# Altium schematic sheet ZP_Force_Plates.SchDoc
size Tabloid; Organization: Altium Limited; Address1: L3, 12a Rodborough Rd; Address2: Frenchs Forest; Address3: NSW; Address4: Australia 2086
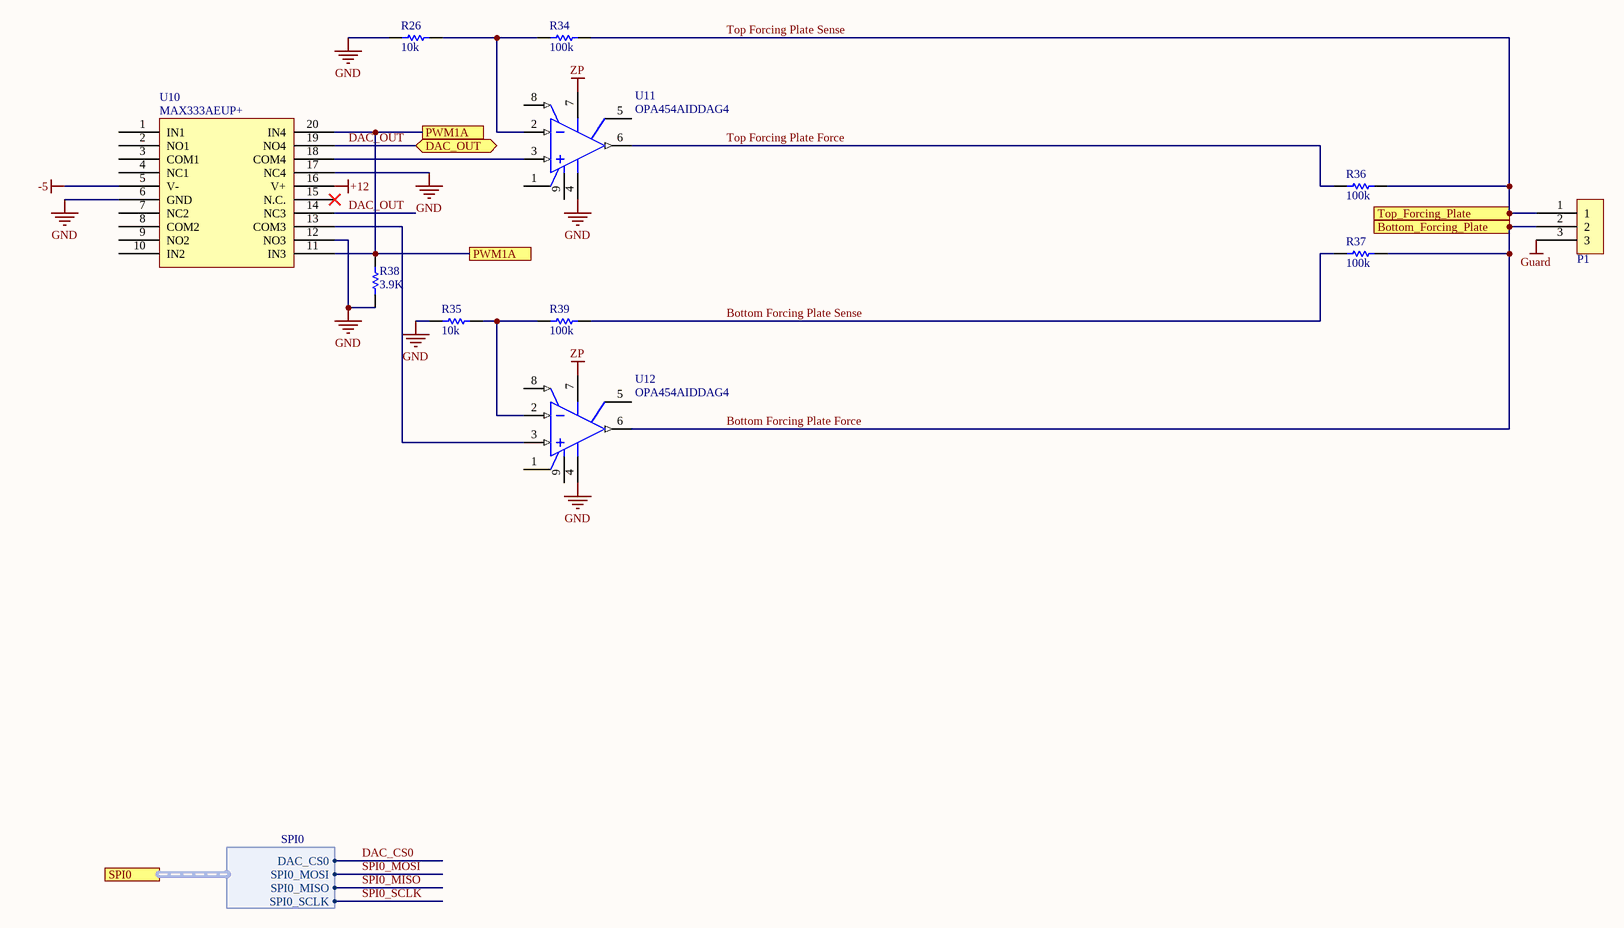
[diagram p0: ZP_Force_Plates.SchDoc]

## Parts
P1  Triax_Conn  [Triax_Conn]  (value not drawn)
R26  10k  [RESC0402(1005)_M]
R34  100k  [RESC0402(1005)_M]
R35  10k  [RESC0402(1005)_M]
R36  100k  [RESC0402(1005)_M]
R37  100k  [RESC0402(1005)_M]
R38  3.9K  [RESC0402(1005)_M]
R39  100k  [RESC0402(1005)_M]
U10  MAX333AEUP+  [TSOP65P640X90-20N]
U11  OPA454AIDDAG4  [TI-DDA8-2745X2245TP_N]
U12  OPA454AIDDAG4  [TI-DDA8-2745X2245TP_N]

## Ports
Bottom_Forcing_Plate, DAC_OUT, PWM1A, SPI0 (harness SPI0), Top_Forcing_Plate

## Harnesses
SPI0: DAC_CS0, SPI0_MOSI, SPI0_MISO, SPI0_SCLK

## Nets
+12: U10.16(V+)
-5: U10.5(V-)
GND: R26.1 R35.1 R38.1 U10.6(GND) U10.12(NO3) U10.17(NC4) U11.4(V-) U12.4(V-)
Guard: P1.3
ZP: U11.7(V+) U12.7(V+)
Bottom Forcing Plate Force: P1.2 R37.1 U12.6(OUT) ; port Bottom_Forcing_Plate
Bottom Forcing Plate Sense: R37.2 R39.2
DAC_CS0: port SPI0.DAC_CS0
DAC_OUT: U10.14(NC3) U10.19(NO4) ; port DAC_OUT
PWM1A: R38.2 U10.11(IN3) U10.20(IN4) ; port PWM1A
SPI0_MISO: port SPI0.SPI0_MISO
SPI0_MOSI: port SPI0.SPI0_MOSI
SPI0_SCLK: port SPI0.SPI0_SCLK
Top Forcing Plate Force: R36.2 U11.6(OUT)
Top Forcing Plate Sense: P1.1 R34.2 R36.1 ; port Top_Forcing_Plate
NetR26_2: R26.2 R34.1 U11.2(IN-)
NetR35_2: R35.2 R39.1 U12.2(IN-)
NetU10_13: U10.13(COM3) U12.3(IN+)
NetU10_18: U10.18(COM4) U11.3(IN+)

Not connected (* = marked no-connect by the designer): U10 1(IN1) 2(NO1) 3(COM1) 4(NC1) 7(NC2) 8(COM2) 9(NO2) 10(IN2) 15(N.C.)*; U11 1(E/D_COM) 5(STATUS_FLAG) 8(E/D) 9(EP); U12 1(E/D_COM) 5(STATUS_FLAG) 8(E/D) 9(EP)

## Notes on the sheet
- Title
- Size:
- Date:
- Tabloid
- Number:
- Time:
- Revision:
- Sheet
- of
- File:

## Library data of the parts
R26 R34 R35 R38 R39 = CMP-1011-00463-1
R36 R37 = CMP-1011-00651-1
U10 = MAX333CWP+: IC SWITCH QUAD SPDT 20TSSOP; Manufacturer: Maxim Integrated; Multiplexer/Demultiplexer Circuit: 2:1; On-State Resistance (Max): 45 Ohm; Channel-to-Channel Matching (&Delta;Ron): 2 Ohm (Max); Voltage - Supply, Single (V+): 10 V ~ 30 V; Voltage - Supply, Dual (V±): ±4.5 V ~ 20 V; Switch Time (Ton, Toff) (Max): 175ns, 145ns; Charge Injection: 2pC; Channel Capacitance (CS(off), CD(off)): 5pF; Current - Leakage (IS(off)) (Max): 250pA; Crosstalk: -78dB @ 1MHz; Supplier 1: Digi-Key; Supplier Part Number 1: MAX333AEUP+-ND; Manufacturer Part Number: MAX333AEUP+; RoHS: RoHS Compliant; Category: Integrated Circuits (ICs); Stock 1: 1328; Pricing 1: 1=6.77, 10=6.432, 25=6, 50=5.8942 (USD); Packaging: Tube; Part Status: Active; Switch Circuit: SPDT; -3db Bandwidth: -; Operating Temperature: -40°C ~ 85°C (TA); Package / Case: 20-TSSOP (0.173", 4.40mm Width); Supplier Device Package: 20-TSSOP; Base Part Number: MAX333; ComponentLink1URL: https://pdfserv.maximintegrated.com/en/ds/MAX333A.pdf; ComponentLink1Description: https://pdfserv.maximintegrated.com/en/ds/MAX333A.pdf
U11 U12 = CMP-0017-00715-1: High Voltage (100V), High-Current (50mA) Operational Amplifier, G=1 Stable, 10 to 100 V, -55 to 125 degC, 8-pin SOP (DDA8), Green (RoHS & no Sb/Br); Manufacturer: Texas Instruments; Sub Family: General Purpose Amplifier, High Output Current Amplifier (>=50mA), High Supply Voltage Amplifier (>=30V), Precision Amplifier; Offset Drift(Typ)(uV/C): 1.6; Slew Rate(Typ)(V/us): 13; Number of Channels: 1; Total Supply Voltage(Max)(+5V is 5, +/-5V is 10): 100; Total Supply Voltage(Min)(+5V is 5, +/-5V is 10): 10; Vio (25C)(Max)(mV): 4; GBW(Typ)(MHz): 2.5; Vn at 1kHz(Typ)(nV/rtHz): 47; Rating: Catalog; ComponentLink1URL: http://www.ti.com/; PartNumber: OPA454AIDDAG4; ComponentLink1Description: Manufacturer URL; Eco-Plan: Green (RoHS & no Sb/Br); ComponentLink3URL: http://www.ti.com/litv/pdf/mpds092e; IIB(Max)(pA): 100; ComponentLink2URL: http://www.ti.com/lit/ds/symlink/opa454.pdf; ComponentLink3Description: Package Specification; DatasheetVersion: SBOS391A; Iq per channel(Max)(mA): 4; PackageVersion: 4202561/F, 12/2011; Code_JEDEC: MS-012; CMRR(Min)(dB): 100; PackageReference: DDA8-2745X2245TP; Mounting Technology: Surface Mount; ComponentLink2Description: Datasheet; PackageDescription: 8-Pin PowerPAD(TM) Plastic Small Outline, Body 3.9 x 4.9 mm, Pitch 1.27 mm